# Altium project Meshtastic.PrjPcb
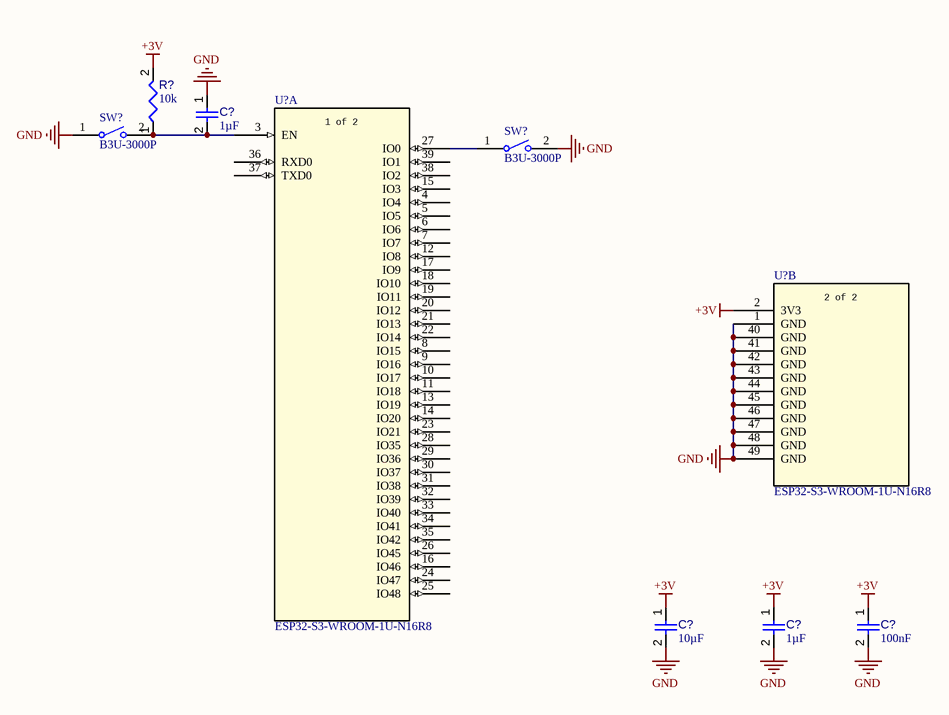
[diagram p0: ESP32.SchDoc]
6 sheets, 21 parts. Net scope: flat (ports and power ports of the same name join across sheets).
Sheets:
  ESP32.SchDoc
  GPS.SchDoc
  LORA.SchDoc
  POWER.SchDoc
  BMS.SchDoc
  CHARGING.SchDoc

## Sheet ESP32.SchDoc
size A4; SheetNumber: 1; SheetTotal: 6

### Parts
(Parts that share a designator on the sheet are numbered #1, #2 ... from top to bottom, then left to right.)
C?#1  value 1µF  [CAPC1608X94X35NL15T15]  (hidden comment: Capacitor 1 uF +/- 10% 16 V 0603)
C?#2  value 10µF  [CAPC0603(1608)100_L]  (hidden comment: Capacitor 10µF +/-20% 10V 0603)
C?#3  value 1µF  [CAPC1608X94X35NL15T15]  (hidden comment: Capacitor 1 uF +/- 10% 16 V 0603)
C?#4  value 100nF  [CAPC1608X90X40NL10T20]  (hidden comment: Capacitor 100 nF +/-10% 50 V 0603)
R?#1  value 10k  [RESC1608X55X25ML10T15]  (hidden comment: Resistor 10k +/-1% 0603 100 mW)
SW?#1  B3U-3000P  [OMRON-B3U-3000P_V]
SW?#2  B3U-3000P  [OMRON-B3U-3000P_V]
U?#1  ESP32-S3-WROOM-1U-N16R8  [ESP32-S3-WROOM-1U_EXP]  (part A of 2)
U?#2  ESP32-S3-WROOM-1U-N16R8  [ESP32-S3-WROOM-1U_EXP]  (part B of 2)

### Nets
+3V: C?#2.1 C?#3.1 C?#4.1 R?#1.2 U?#2.2(3V3)
GND: C?#1.1 C?#2.2 C?#3.2 C?#4.2 SW?#1.1 SW?#2.2 U?#2.1(GND) U?#2.40(GND) U?#2.41(GND) U?#2.42(GND) U?#2.43(GND) U?#2.44(GND) U?#2.45(GND) U?#2.46(GND) U?#2.47(GND) U?#2.48(GND) U?#2.49(GND)
NetC?#1_2: C?#1.2 R?#1.1 SW?#1.2 U?#1.3(EN)
NetSW?#2_1: SW?#2.1 U?#1.27(IO0)

Not connected (* = marked no-connect by the designer): U?#1 4(IO4) 5(IO5) 6(IO6) 7(IO7) 8(IO15) 9(IO16) 10(IO17) 11(IO18) 12(IO8) 13(IO19) 14(IO20) 15(IO3) 16(IO46) 17(IO9) 18(IO10) 19(IO11) 20(IO12) 21(IO13) 22(IO14) 23(IO21) 24(IO47) 25(IO48) 26(IO45) 28(IO35) 29(IO36) 30(IO37) 31(IO38) 32(IO39) 33(IO40) 34(IO41) 35(IO42) 36(RXD0) 37(TXD0) 38(IO2) 39(IO1)

### Notes on the sheet
- (in symbol ESP32-S3-WROOM-1U-N16R8, part A) 1 of 2
- (in symbol ESP32-S3-WROOM-1U-N16R8, part B) 2 of 2

### Library data of the parts
C?#1 C?#3 = CMP-001-00003-6: Chip Capacitor, 1 uF, +/- 10%, 16 V, 0603 (1608 Metric); Voltage Rating: 16V; Capacitor Type: Ceramic; Max Operating Temperature: 125°C; Pins: 2; Tolerance: 10%; Min Operating Temperature: -55°C; RoHS Compliant: True; Mounting Technology: SM; Case/Package: 0603
C?#2 = CMP-001-00075-4: Chip Capacitor, 10µF +/-20%, 10V, 0603, Thickness 1 mm; Tolerance: 10%; Voltage Rating: 10V; Max Operating Temperature: 85°C; Pins: 2; Case/Package: 0603; Mounting Technology: SMT; Min Operating Temperature: -55°C
C?#4 = CMP-001-00017-6: Chip Capacitor, 100 nF, +/- 10%, 50 V, 0603 (1608 Metric); Voltage Rating: 50V; Capacitor Type: Ceramic; Tolerance: 10%; Mounting Technology: SM; Max Operating Temperature: 125°C; RoHS Compliant: True; Pins: 2; Case/Package: 0603; Min Operating Temperature: -55°C
R?#1 = CMP-009-00017-5: Chip Resistor, 10 KOhm, +/- 1%, 01 W, -55 to 155 degC, 0603 (1608 Metric); Voltage Rating: 50V; Power: 100mW; RoHS Compliant: True; Min Operating Temperature: -55°C; Pins: 2; Case/Package: 0603; Mounting Technology: SM; Max Operating Temperature: 155°C; Tolerance: 1%
SW?#1 SW?#2 = CMP-011-00005-2: Tactile Switch, SPST-NO, 0.05 A, 12 V, -25 to 70 degC, 2-Pin SMD, RoHS, Tape and Reel; Manufacturer: Omron Electronic Components; Operating Force: 162gf; Voltage Rating (DC): 12V; Current Rating: 50mA; IP Rating: IP40; Throw Configuration: SPST; Max Contact Resistance: 100mohm; RoHS Compliant: True; Contact Current Rating: 50mA; Manufacturer URL: http://www.omron.com/; Packaging: TapeandReel; Max Voltage Rating (DC): 12V; Contact Material: Silver; Datasheet Version: Jan-15; Package Reference: B3U-3000P; Package Description: 2-Pin Surface Mount Device, Body 4 x 3.2 mm; Min Operating Temperature: -25°C; Package Quantity: 4000; Max Operating Temperature: 70°C; Max Current Rating: 50mA; Voltage Rating: 12V; Case/Package: B3U-3000P; Mounting Technology: SM; Datasheet URL: https://www.omron.com/ecb/products/pdf/en-b3u.pdf
U?#1 U?#2 = ESP32-S3-WROOM-1U-N16R8: Description; Manufacturer_Name: Espressif Systems; Copyright: Copyright (C) 2026 Ultra Librarian. All rights reserved.; Manufacturer_Part_Number: ESP32-S3-WROOM-1U-N16R8; RefDes: RefDes; Type: Type

## Sheet GPS.SchDoc
size A4; SheetNumber: 2; SheetTotal: 6
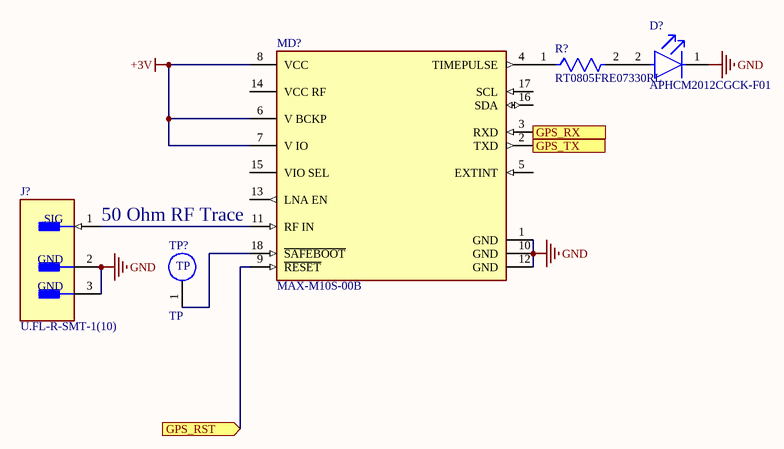
[diagram p1: GPS.SchDoc]

### Parts
(Parts that share a designator on the sheet are numbered #1, #2 ... from top to bottom, then left to right.)
D?  APHCM2012CGCK-F01  [FP-APHCM2012CGCK-F01-MFG]
J?#1  U.FL-R-SMT-1(10)  [FP-U_FL-R-SMT-1_10-MFG]
MD?  MAX-M10S-00B  [FP-MAX-M10S-00B-MFG]
R?#2  RT0805FRE07330RL  [FP-RT0805-MFG]
TP?  TP  (no BOM)

### Ports
GPS_RST (in), GPS_RX (in), GPS_TX (out)

### Nets
+3V: MD?.6(V_BCKP) MD?.7(V_IO) MD?.8(VCC)
GND: D?.1(C) J?#1.2(GND) J?#1.3(GND) MD?.1(GND) MD?.10(GND) MD?.12(GND)
NetD?_2: D?.2(A) R?#2.2
NetJ?#1_1: J?#1.1(SIG) MD?.11(RF_IN)
NetMD?_2: MD?.2(TXD) ; port GPS_TX
NetMD?_3: MD?.3(RXD) ; port GPS_RX
NetMD?_4: MD?.4(TIMEPULSE) R?#2.1
NetMD?_9: MD?.9(~{RESET}) ; port GPS_RST
NetMD?_18: MD?.18(~{SAFEBOOT}) TP?.1(TP1)

Not connected (* = marked no-connect by the designer): MD? 5(EXTINT) 13(LNA_EN) 14(VCC_RF) 15(VIO_SEL) 16(SDA) 17(SCL)

### Notes on the sheet
- 50 Ohm RF Trace

### Library data of the parts
D? = CMP-44529-000062-1: LED GREEN CLEAR CHIP SMD; Dominant Wavelength: 570nm; Forward Current: 20mA; Number of LEDs: 1; Luminous Intensity: 40mcd; Forward Voltage: 2.1V; Viewing Angle: 110°; Illumination Color: Green; Lens Style: Clear; Mount: Surface Mount; Length: 2mm; Max Operating Temperature: 85°C; Series: APHCM; Width: 1.25mm; Lead Free: Lead Free; Wavelength: 570nm; Package Quantity: 1; Number of Pins: 2; Case Code (Metric): 2012; RoHS Compliant: Yes; Packaging: Tape and Reel; Lens Color: Clear; Case/Package: 0805; Case Code (Imperial): 0805; Test Current: 20mA; Color: Green; Min Operating Temperature: -40°C; Height: 0.4mm
J?#1 = CMP-2000-05152-3: CONN U.FL RCPT STR 50 OHM SMD; Max Frequency: 6GHz; Connector Type: Coaxial; Body Plating: Silver; Body Material: Bronze; Impedance: 50R; Dielectric Material: Polymer; Insulation Resistance: 500MR; Gender: Male; Packaging: Cut Tape; Length: 3mm; Package Quantity: 2500; Termination: Solder; Lead Free: Lead Free; Series: U.FL; Min Operating Temperature: -40°C; Fastening Type: Snap; Contact Material: Brass; Orientation: Straight; Wire/Cable Type: Coaxial; Frequency: 6GHz; Contact Plating: Gold; Depth: 3.1mm; Weight: 0.001764oz; Max Operating Temperature: 90°C; Radiation Hardening: No; REACH SVHC: No SVHC; Mount: Surface Mount; Housing Color: Beige
MD? = CMP-207130-000026-1: GNSS LCC RX, ROM, TCXO, LNA, SAW
R?#2 = CMP-03412-000042-1: Res Thin Film 0805 330K Ohm 1% 1/8W ±50ppm/°C Molded SMD SMD Paper T/R; Manufacturer: Yageo; Resistance: 330Ω; Value: 330Ω; Power Rating: 0.125W; Tolerance: 0.0001; Voltage Rating: 150V; Manufacturer Part Number: RT0805FRE07330RL; Height: 0.6mm; Octopart: https://octopart.com/rt0805fre07330rl-yageo-39785396; Package: RT0805; Temperature: -55°C to +155°C; Category: Res; RoHS: TRUE; ComponentLink2Description: Datasheet; Automotive: No; Device Class L3: Chip SMD Resistors; Temperature Range High: +155°C; Device Class L1: Passive Components; Temperature Coefficient: 50 ppm/°C; Series: RT; Composition: Thin Film; Digikey Description: Res Thin Film 0805 330K Ohm 1% 1/8W ±50ppm/°C Molded SMD SMD Paper T/R; Mouser Description: Res Thin Film 0805 330K Ohm 1% 1/8W ±50ppm/°C Molded SMD SMD Paper T/R; Device Class L2: Resistors; Temperature Range Low: -55°C; Ipc Land Pattern Name: RESC200125X50; Lead Free: Yes; ComponentLink2URL: http://www.yageo.com/documents/recent/PYu-RT_1-to-0.01_RoHS_L_9.pdf; Footprint Url: http://www.yageo.com/exep/pages/download/literatures/PYu-R_Mount_10.pdf
TP? = Testpoint1

## Sheet LORA.SchDoc
size A4; SheetNumber: 3; SheetTotal: 6
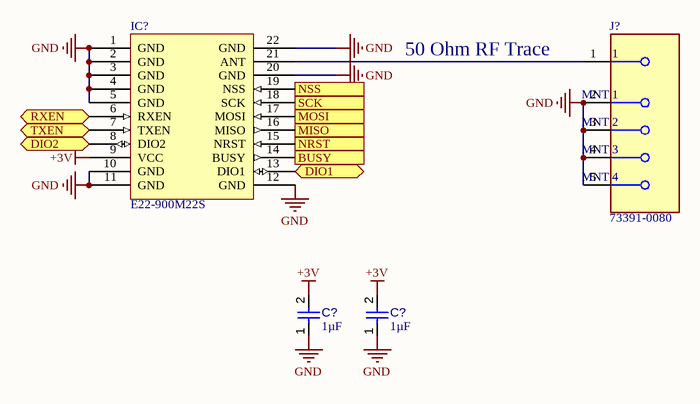
[diagram p2: LORA.SchDoc]

### Parts
(Parts that share a designator on the sheet are numbered #1, #2 ... from top to bottom, then left to right.)
C?#5  value 1µF  [CAPC2013X135X45NL10T25]  (hidden comment: Capacitor 1 uF +/- 10% 50 V 0805)
C?#6  value 1µF  [CAPC2013X135X45NL10T25]  (hidden comment: Capacitor 1 uF +/- 10% 50 V 0805)
IC?  E22-900M22S  [PE22(900M22S)]
J?#2  73391-0080  [FP-73391-0080-MFG]

### Ports
BUSY (out), DIO1 (bidir), DIO2 (bidir), MISO (out), MOSI (in), NRST (in), NSS (in), RXEN (bidir), SCK (in), TXEN (bidir)

### Nets
+3V: C?#5.2 C?#6.2 IC?.9(VCC)
GND: C?#5.1 C?#6.1 IC?.1(GND) IC?.2(GND) IC?.3(GND) IC?.4(GND) IC?.5(GND) IC?.10(GND) IC?.11(GND) IC?.12(GND) IC?.20(GND) IC?.22(GND) J?#2.2(MNT_1) J?#2.3(MNT_2) J?#2.4(MNT_3) J?#2.5(MNT_4)
NetIC?_6: IC?.6(RXEN) ; port RXEN
NetIC?_7: IC?.7(TXEN) ; port TXEN
NetIC?_8: IC?.8(DIO2) ; port DIO2
NetIC?_13: IC?.13(DIO1) ; port DIO1
NetIC?_14: IC?.14(BUSY) ; port BUSY
NetIC?_15: IC?.15(NRST) ; port NRST
NetIC?_16: IC?.16(MISO) ; port MISO
NetIC?_17: IC?.17(MOSI) ; port MOSI
NetIC?_18: IC?.18(SCK) ; port SCK
NetIC?_19: IC?.19(NSS) ; port NSS
NetIC?_21: IC?.21(ANT) J?#2.1

### Notes on the sheet
- 50 Ohm RF Trace

### Library data of the parts
C?#5 C?#6 = CMP-001-00007-6: Chip Capacitor, 1 uF, +/- 10%, 50 V, 0805 (2012 Metric); Capacitor Type: Ceramic; Voltage Rating: 50V; Min Operating Temperature: -55°C; RoHS Compliant: True; Mounting Technology: SM; Case/Package: 0805; Max Operating Temperature: 125°C; Tolerance: 10%; Pins: 2
J?#2 = CMP-00257-00776539-1: 73391-0080 RF Connector, SMA RA JACK PCB 73391 SMA RF Connectors Series; Manufacturer Lifecycle Status: ACTIVE; NexarPartId: 776539; Max Frequency: 18GHz; Polarity: Standard; Impedance: 50Ω; Connector Type: Coaxial, SMA; Body Material: Zinc; Body Plating: Nickel; REACH SVHC: Unknown; Contact Plating: Gold; Radiation Hardening: No; Mount: Through Hole; Depth: 6.35mm; Length: 14.8mm; Case/Package: SMA; Lifecycle Status: Production; Contact Material: Copper; Orientation: Right Angle; Termination: Solder; Insulation Material: Teflon; Frequency: 18GHz; RoHS: Compliant; Country of Origin: TW; Halogen Free: Low Halogen; Plating: Nickel

## Sheet POWER.SchDoc
size A4; SheetNumber: 4; SheetTotal: 7
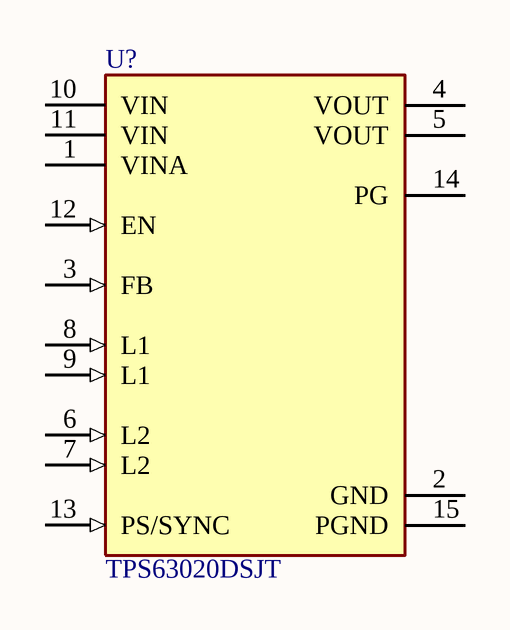
[diagram p3: POWER.SchDoc]

### Parts
(Parts that share a designator on the sheet are numbered #1, #2 ... from top to bottom, then left to right.)
U?#3  TPS63020DSJT  [FP-DSJ0014A-MFG]

### Nets

Not connected (* = marked no-connect by the designer): U?#3 1(VINA) 2(GND) 3(FB) 4(VOUT) 5(VOUT) 6(L2) 7(L2) 8(L1) 9(L1) 10(VIN) 11(VIN) 12(EN) 13(PS/SYNC) 14(PG) 15(PGND)

### Library data of the parts
U?#3 = CMP-2000-07282-2: IC REG BCK BST ADJ 3.5A 14VSON; Manufacturer: Texas Instruments; Switching Frequency: 2400kHz; Output Voltage: 1.2-5.5V; Nominal Supply Current: 25uA; Standoff Height: 0mm; Switching Topology: Buck-Boost; Min Supply Voltage: 1.8V; Description: IC REG BUCK BST ADJ 3.5A 14VSON; Output Type: AdjustableProgrammable; Max Junction Temp: +125°C; Number Of Outputs: 1; Output Current: 3A; Max Supply Voltage: 5.5V; ComponentLink2URL: https://www.ti.com/lit/ds/symlink/tps63020.pdf; Ambient Temperature Range High: +85°C; Digikey Description: IC REG BCK BST ADJ 3.5A 14VSON; Ambient Temperature Range Low: -40°C; Manufacturer Part Number: TPS63020DSJT; Automotive: No; Package: DSJ0014A; Category: IC; Temperature Range High: +85°C; Temperature: -40°C to +85°C; Octopart: https://octopart.com/tps63020dsjt-texas+instruments-12976119; Temperature Range Low: -40°C; Device Class L3: Voltage Regulators - Switching; Device Class L2: Power Management ICs; RoHS: TRUE; Lead Free: Yes; Height: 1mm; Device Class L1: Integrated Circuits (ICs); Mouser Description: Voltage Regulators - Switching Regulators 93% Eff Buck-Boost Converter; ComponentLink2Description: Datasheet

## Sheet BMS.SchDoc
size A4; SheetNumber: 5; SheetTotal: 7
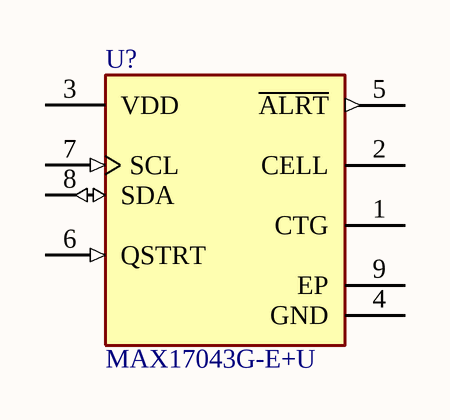
[diagram p4: BMS.SchDoc]

### Parts
(Parts that share a designator on the sheet are numbered #1, #2 ... from top to bottom, then left to right.)
U?#4  MAX17043G-E+U  [FP-T823-1-MFG]

### Nets

Not connected (* = marked no-connect by the designer): U?#4 1(CTG) 2(CELL) 3(VDD) 4(GND) 5(~{ALRT}) 6(QSTRT) 7(SCL) 8(SDA) 9(EP)

### Library data of the parts
U?#4 = CMP-05715-000095-1: 1-Cell Fuel Gauge with ModelGauge and Low-Battery Alert; Manufacturer: Maxim; Max Supply Voltage: 4.5V; Standoff Height: 0mm; Min Supply Voltage: 2.5V; Number Of Cells: 1; Nominal Supply Current: 50uA; Device Class L2: Power Management ICs; Manufacturer Part Number: MAX17043G-E+U; Device Class L1: Integrated Circuits (ICs); Footprint Url: https://pdfserv.maximintegrated.com/land_patterns/90-0091.PDF; RoHS: TRUE; Category: IC; Temperature: -20°C to +70°C; Temperature Range High: +70°C; Package: T823-1; Device Class L3: Battery Management; Height: 0.8mm; Temperature Range Low: -20°C; ComponentLink2Description: Datasheet; Automotive: No; Lead Free: Yes; ComponentLink2URL: https://datasheets.maximintegrated.com/en/ds/MAX17043-MAX17044.pdf; Octopart: https://octopart.com/max17043g-e%2Bu-maxim+integrated-38558398

## Sheet CHARGING.SchDoc
size A4; SheetNumber: 6; SheetTotal: 7
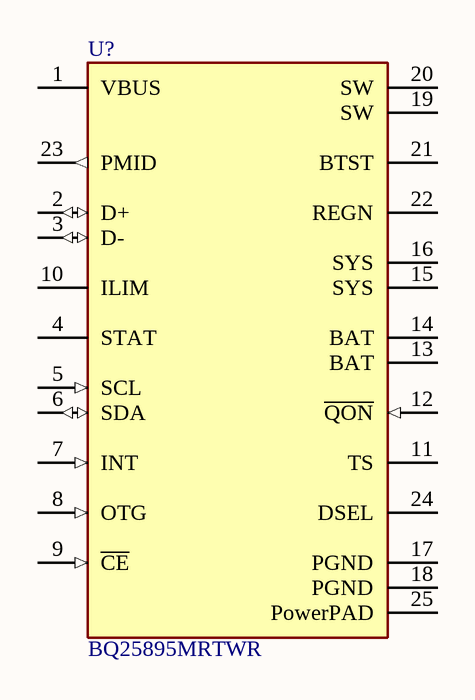
[diagram p5: CHARGING.SchDoc]

### Parts
(Parts that share a designator on the sheet are numbered #1, #2 ... from top to bottom, then left to right.)
U?#5  BQ25895MRTWR  [FP-RTW0024H-MFG]

### Nets

Not connected (* = marked no-connect by the designer): U?#5 1(VBUS) 2(D+) 3(D-) 4(STAT) 5(SCL) 6(SDA) 7(INT) 8(OTG) 9(~{CE}) 10(ILIM) 11(TS) 12(~{QON}) 13(BAT) 14(BAT) 15(SYS) 16(SYS) 17(PGND) 18(PGND) 19(SW) 20(SW) 21(BTST) 22(REGN) 23(PMID) 24(DSEL) 25(PowerPAD)

### Library data of the parts
U?#5 = CMP-04911-000051-1: IC BATT CHG LI-ION 1CELL 24WQFN; Max Charge Current: 5A; Output Voltage: 5.5V; Interface: I2C; Number of Cells: 1; Fault Protection: Over Temperature; Max Supply Voltage: 14V; Max Operating Temperature: 85°C; Mount: Surface Mount; Contact Plating: Gold; Min Operating Temperature: -40°C; Output Current: 5A; RoHS Compliant: Yes; Lead Free: Lead Free; Packaging: Cut Tape; Number of Pins: 24

## Nets that join several sheets
+3V: ESP32 (5 pins), GPS (MD?.6 MD?.7 MD?.8), LORA (C?#5.2 C?#6.2 IC?.9)
GND: ESP32 (17 pins), GPS (6 pins), LORA (16 pins)